# EAGLE design Temperature Sensor Rev.4 (EAGLE 7.6.0)
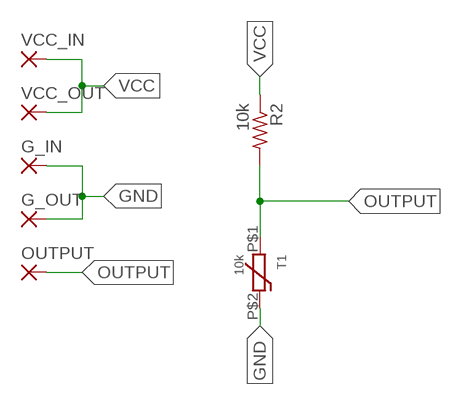
[diagram p0: schematic, sheet 1]

## Parts
G_IN  1,6/0,8  [1,6/0,8]
G_OUT  1,6/0,8  [1,6/0,8]
OUTPUT  1,6/0,8  [1,6/0,8]
R2  10k  R-US_R0603  [R0603]
T1  10k  THERMISTOR  [0603]
VCC_IN  1,6/0,8  [1,6/0,8]
VCC_OUT  1,6/0,8  [1,6/0,8]

## Nets
GND: G_IN.1(P) G_OUT.1(P) T1.P$2
OUTPUT: OUTPUT.1(P) R2.2 T1.P$1
VCC: R2.1 VCC_IN.1(P) VCC_OUT.1(P)

## Library data of the parts
G_IN G_OUT OUTPUT VCC_IN VCC_OUT = wirepad:1,6/0,8: THROUGH-HOLE PAD
R2 = resistor:R-US_: RESISTOR, American symbol
T1 = formula electric:THERMISTOR

## Board
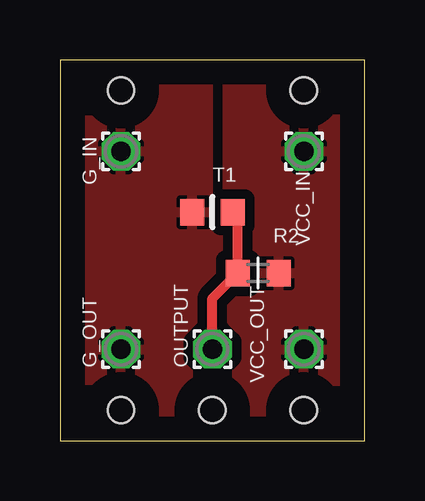
[diagram p1: board, top side]
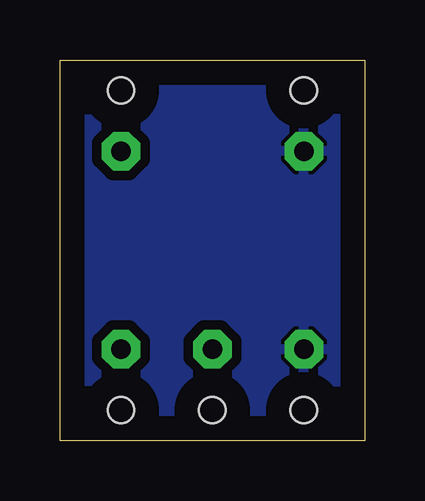
[diagram p2: board, bottom side, seen from below]

Size 12.7 x 15.88 mm. Coordinates in mm from the lower left corner, seen from the top.
Outline: 0,0 12.7,0 12.7,15.88 0,15.88 0,0
Copper layers (1*16): Top 0.035mm / dielectric 1.5mm / Bottom 0.035mm
Design rules "default *": minimum track width 6mil, minimum drill 13mil, track to track 6mil, track to pad 6mil, pad to pad 6mil, via to via 6mil, smd to smd 6mil, copper to edge 40mil, drill to drill 8mil, minimum pad ring 10mil, minimum via ring 8mil, stop-mask expansion 4mil, vias tented up to drill 0mil, thermal gap 6mil
Holes 1.1 mm at 2.54,1.27 6.35,1.27 10.16,1.27 10.16,14.61 2.54,14.61

### Footprints (pad centres in the part's own frame; a part is rotated, then mirrored left to right if it is on the bottom)
1,6/0,8 = drill 0.813 pad 1.6 octagon: 1 0,0
R0603 = smd 1 x 1.1: 1 -0.85,0; 2 0.85,0
0603 = smd 1 x 1.1: P$1 -0.85,0; P$2 0.85,0

### Placement (x,y rotation side)
G_IN  2.54,12.06 90 top
G_OUT  2.54,3.81 90 top
OUTPUT  6.35,3.81 90 top
R2  8.26,6.99 180 top
T1  6.35,9.53 180 top
VCC_IN  10.16,12.06 90 top
VCC_OUT  10.16,3.81 90 top

### Tracks (layer width: path | path; a pad name or v marks a point on that pad's centre or on a via)
GND
  pour Top (isolate 0.406, rank 6): 0,0 12.7,0 12.7,15.88 0,15.88
  pour Bottom (isolate 0.406, rank 6): 0,0 12.7,0 12.7,15.88 0,15.88
OUTPUT
  Top 0.406: OUTPUT.1 6.35,5.93 R2.2 7.41,9.32 T1.P$1
VCC
  pour Top (isolate 0.406): 12.7,0 6.99,0 6.99,15.88 12.7,15.88